# EAGLE design hello_radio_016 (EAGLE 5.10)
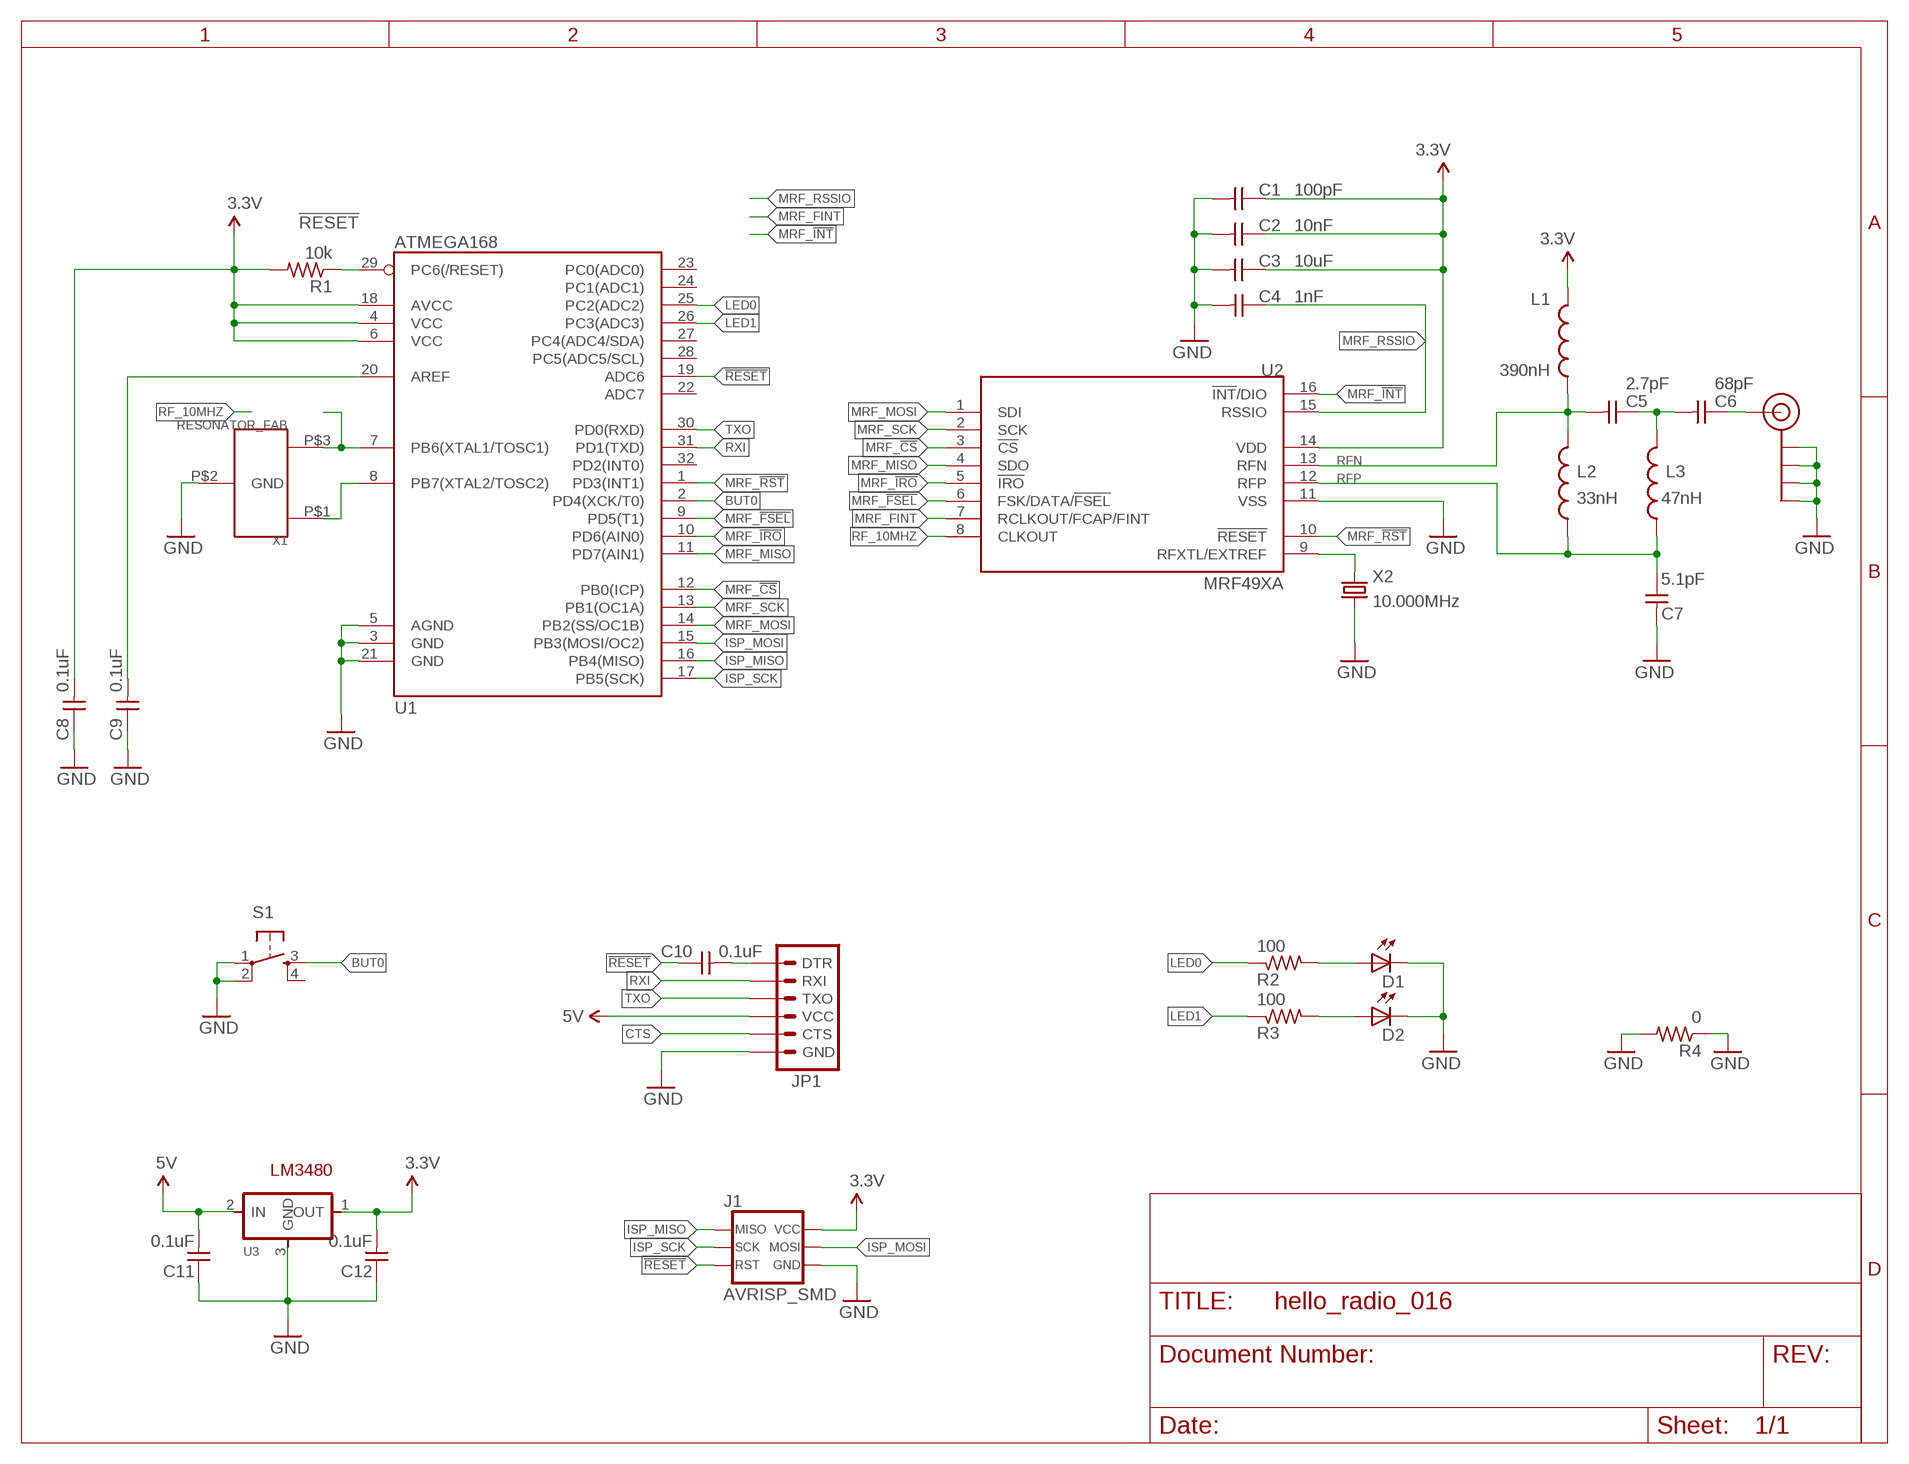
[diagram p0: schematic, sheet 1]

## Parts
C1  100pF  CAPACITOR_FAB_1206  [FAB_1206]
C2  10nF  CAPACITOR_FAB_1206  [FAB_1206]
C3  10uF  CAPACITOR_FAB_1206  [FAB_1206]
C4  1nF  CAPACITOR_FAB_1206  [FAB_1206]
C5  2.7pF  CAPACITOR_FAB_0603  [FAB_0603]
C6  68pF  CAPACITOR_FAB_0603  [FAB_0603]
C7  5.1pF  CAPACITOR_FAB_0603  [FAB_0603]
C8  0.1uF  CAPACITOR_FAB_1206  [FAB_1206]
C9  0.1uF  CAPACITOR_FAB_1206  [FAB_1206]
C10  0.1uF  CAPACITOR_FAB_1206  [FAB_1206]
C11  0.1uF  CAPACITOR_FAB_1206  [FAB_1206]
C12  0.1uF  CAPACITOR_FAB_1206  [FAB_1206]
D1  LED1206  [1206]
D2  LED1206  [1206]
J1  AVRISP_SMD  [2X03SMD]
J$1  SMA_EDGE  [SMA-EDGE]
JP1  FTDI_SERIAL_HEADER_SMD  [1X06_SMD]
L1  390nH  INDUCTOR_FAB_0603  [FAB_0603]
L2  33nH  INDUCTOR_FAB_0603  [FAB_0603]
L3  47nH  INDUCTOR_FAB_0603  [FAB_0603]
R1  10k  RESISTOR_FAB_1206  [FAB_1206]
R2  100  RESISTOR_FAB_1206  [FAB_1206]
R3  100  RESISTOR_FAB_1206  [FAB_1206]
R4  0  RESISTOR_FAB_1206  [FAB_1206]
S1  6MM_SWITCH  [6MM_SWITCH]
U1  ATMEGA168  ATMEGA168_FAB_TQFP32-08  [FAB_TQFP32-08]
U2  MRF49XA  MRF49XA_FAB_TSSOP16  [FAB_TSSOP16]
U3  REGULATOR_SOT23  [SOT23]
X1  RESONATOR_FAB  [FABCLASSRES]
X2  10.000MHz  CRYSTAL_ABM7  [CRYSTAL-SMD-ABM7]

## Nets
3.3V [power]: C1.1 C2.1 C3.1 C8.2 C12.2 J1.2(VCC) L1.1 R1.2 U1.4(VCC) U1.6(VCC) U1.18(AVCC) U2.14(VDD) U3.1(OUT)
5V [power]: C11.2 JP1.4(VCC) U3.2(IN)
!RESET: C10.1 J1.5(RST) R1.1 U1.19(ADC6) U1.29(PC6(/RESET))
BUT0: S1.3(S) U1.2(PD4(XCK/T0))
CTS: JP1.5(CTS)
DTR: C10.2 JP1.1(DTR)
GND [power]: C1.2 C2.2 C3.2 C4.2 C7.2 C8.1 C9.1 C11.1 C12.1 D1.2(C) D2.2(C) J1.6(GND) J$1.GND@0(GND) J$1.GND@1(GND) J$1.GND@2(GND) J$1.GND@3(GND) JP1.6(GND) R4.1 R4.2 S1.1(P) S1.2(P1) U1.3(GND) U1.5(AGND) U1.21(GND) U2.11(VSS) U3.3(GND) X1.P$2(GND) X2.P$1
ISP_MISO: J1.1(MISO) U1.16(PB4(MISO))
ISP_MOSI: J1.4(MOSI) U1.15(PB3(MOSI/OC2))
ISP_SCK: J1.3(SCK) U1.17(PB5(SCK))
LED0: R2.1 U1.25(PC2(ADC2))
LED1: R3.1 U1.26(PC3(ADC3))
MRF_!CS: U1.12(PB0(ICP)) U2.3(!CS)
MRF_!FSEL: U1.9(PD5(T1)) U2.6(FSK/DATA/!FSEL)
MRF_!INT: U2.16(!INT!/DIO)
MRF_!IRO: U1.10(PD6(AIN0)) U2.5(!IRO)
MRF_!RST: U1.1(PD3(INT1)) U2.10(!RESET)
MRF_FINT: U2.7(RCLKOUT/FCAP/FINT)
MRF_MISO: U1.11(PD7(AIN1)) U2.4(SDO)
MRF_MOSI: U1.14(PB2(SS/OC1B)) U2.1(SDI)
MRF_RSSIO: C4.1 U2.15(RSSIO)
MRF_SCK: U1.13(PB1(OC1A)) U2.2(SCK)
N$1: D1.1(A) R2.2
N$2: D2.1(A) R3.2
N$5: U1.8(PB7(XTAL2/TOSC2)) X1.P$1(A)
N$6: U1.7(PB6(XTAL1/TOSC1)) X1.P$3(B)
N$7: U2.9(RFXTL/EXTREF) X2.P$2
N$14: C9.2 U1.20(AREF)
RF$3 [RF]: C5.1 C6.2 L3.1
RF_10MHZ: U2.8(CLKOUT)
RF_OUT [RF]: C6.1 J$1.SIG(SIGNAL)
RFN [RF]: C5.2 L1.2 L2.1 U2.13(RFN)
RFP [RF]: C7.1 L2.2 L3.2 U2.12(RFP)
RXI: JP1.2(RXI) U1.31(PD1(TXD))
TXO: JP1.3(TXO) U1.30(PD0(RXD))
Unconnected: S1.4(S1) U1.22(ADC7) U1.23(PC0(ADC0)) U1.24(PC1(ADC1)) U1.27(PC4(ADC4/SDA)) U1.28(PC5(ADC5/SCL)) U1.32(PD2(INT0))

## Notes on the sheet
- LM3480

## Library data of the parts
C1-C12 = hello_radio_016:CAPACITOR: Capacitor Standard 0603 ceramic capacitor, and 0.1" leaded capacitor.
D1 D2 = hello_radio_016:LED
J1 = hello_radio_016:AVRISP
J$1 = hello_radio_016:SMA: SMA Antenna Connector End launch SMA connector. The paste layer has been removed so that the connector can be hand soldered onto the board after reflow.
JP1 = hello_radio_016:FTDI_SERIAL_HEADER
L1-L3 = hello_radio_016:INDUCTOR: Inductors Basic Inductor/Choke - 0603 and 1206. Footprints are not proven and vary greatly between part numbers.
R1-R4 = hello_radio_016:RESISTOR
S1 = hello_radio_016:6MM_SWITCH: OMRON SWITCH
U1 = hello_radio_016:ATMEGA168
U2 = hello_radio_016:MRF49XA
U3 = hello_radio_016:REGULATOR
X1 = hello_radio_016:RESONATOR
X2 = hello_radio_016:CRYSTAL: Crystals Various standard crystals. Proven footprints. Spark Fun Electronics SKU : COM-00534

## Net classes
1 power: width 0.254 mm

## Board
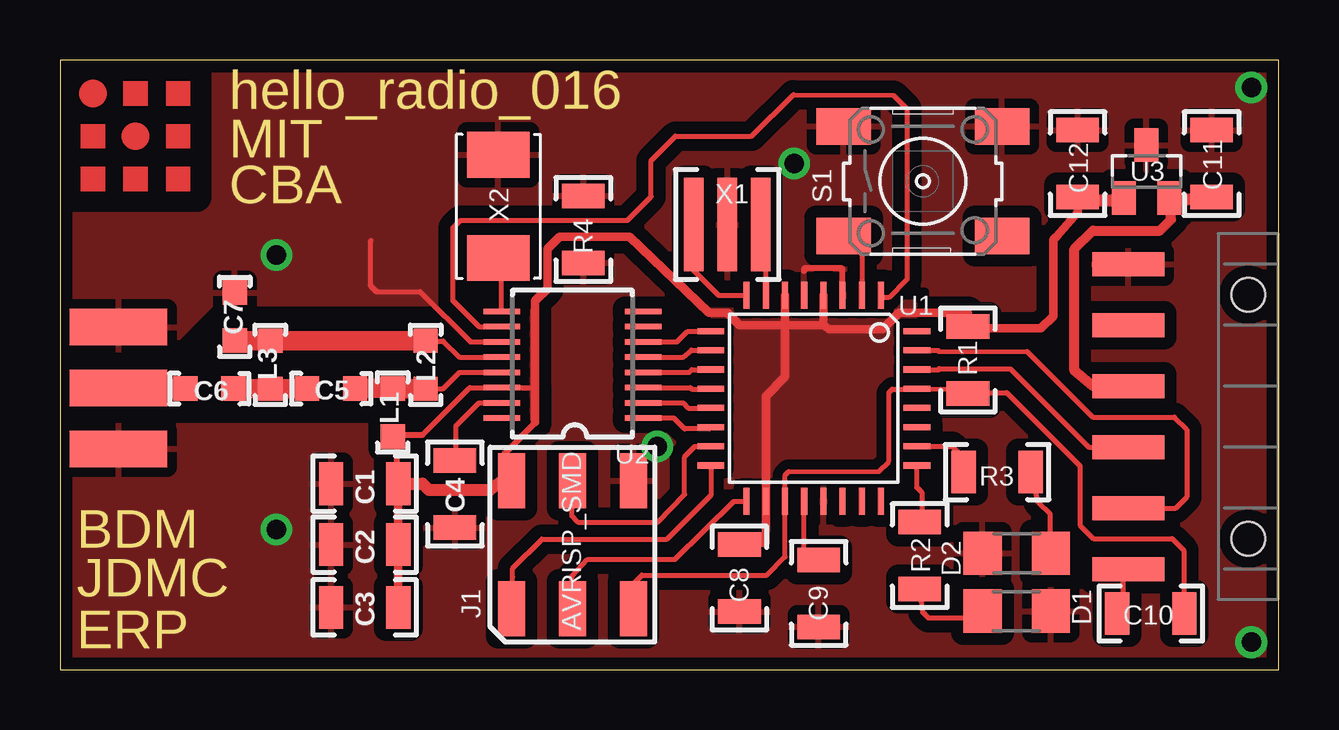
[diagram p1: board, top side]
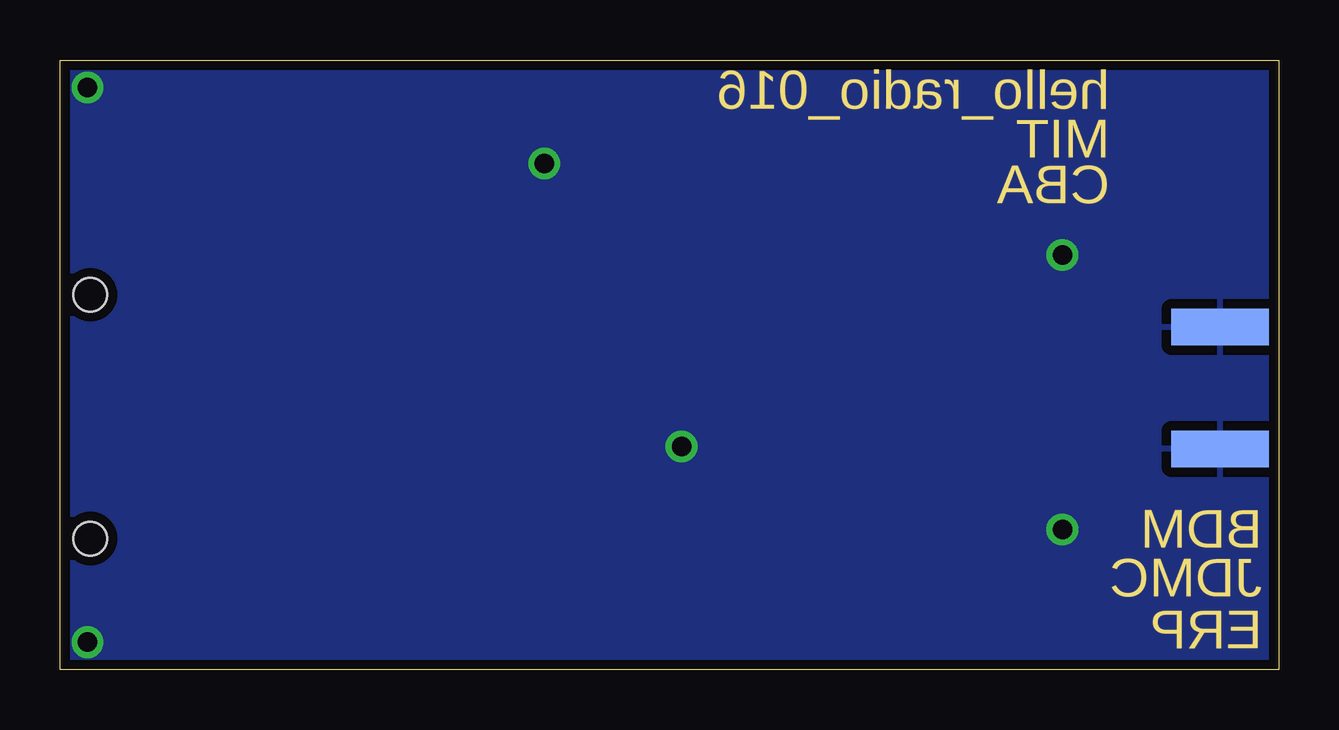
[diagram p2: board, bottom side, seen from below]

Size 50.8 x 25.4 mm. Coordinates in mm from the lower left corner, seen from the top.
Outline: 50.8,0 50.8,25.4 0,25.4 0,0 50.8,0
Copper layers (1*16): Top 0.035mm / dielectric 1.5mm / Bottom 0.035mm
Design rules "hr-fab-01 *": minimum track width 8mil, minimum drill 20mil, track to track 16mil, track to pad 16mil, pad to pad 16mil, via to via 16mil, smd to smd 0mil, copper to edge 16mil, drill to drill 20mil, minimum pad ring 10mil, minimum via ring 10mil, stop-mask expansion 4mil, vias tented up to drill 0mil, thermal gap 16mil
tRestrict: 4 lines

### Footprints (pad centres in the part's own frame; a part is rotated, then mirrored left to right if it is on the bottom)
FAB_1206 = smd 1.016 x 1.778: 1 -1.397,0; 2 1.397,0
FAB_0603 = smd 1.016 x 1.016: 1 -1,0; 2 1,0
1206 = smd 1.6 x 1.803: 1 -1.422,0; 2 1.422,0
2X03SMD = smd 2.286 x 1.118: 1 -2.667,2.54; 2 2.666,2.54; 3 -2.667,0; 4 2.666,0; 5 -2.667,-2.54; 6 2.666,-2.54
SMA-EDGE = smd 1.524 x 4.064: GND@0 0,0; GND@1 5.08,0; SIG 2.54,0 | smd 1.524 x 4.064 bottom: GND@2 0,0; GND@3 5.08,0
1X06_SMD = smd 1 x 3: 1 -6.35,5; 2 -3.81,5; 3 -1.27,5; 4 1.27,5; 5 3.81,5; 6 6.35,5 | hole 1.4: -5.08,0; 5.08,0
6MM_SWITCH = smd 2.286 x 1.524: 1 -3.302,2.286; 2 3.302,2.286; 3 -3.302,-2.286; 4 3.302,-2.286
FAB_TQFP32-08 = smd 1.118 x 0.254: 1 -4.293,2.8; 2 -4.293,2; 3 -4.293,1.2; 4 -4.293,0.4; 5 -4.293,-0.4; 6 -4.293,-1.2; 7 -4.293,-2; 8 -4.293,-2.8; 17 4.293,-2.8; 18 4.293,-2; 19 4.293,-1.2; 20 4.293,-0.4; 21 4.293,0.4; 22 4.293,1.2; 23 4.293,2; 24 4.293,2.8 | smd 0.254 x 1.118: 9 -2.8,-4.293; 10 -2,-4.293; 11 -1.2,-4.293; 12 -0.4,-4.293; 13 0.4,-4.293; 14 1.2,-4.293; 15 2,-4.293; 16 2.8,-4.293; 25 2.8,4.293; 26 2,4.293; 27 1.2,4.293; 28 0.4,4.293; 29 -0.4,4.293; 30 -1.2,4.293; 31 -2,4.293; 32 -2.8,4.293
FAB_TSSOP16 = smd 0.229 x 1.524: 1 -2.223,-2.85; 2 -1.587,-2.85; 3 -0.953,-2.85; 4 -0.318,-2.85; 5 0.318,-2.85; 6 0.953,-2.85; 7 1.587,-2.85; 8 2.223,-2.85; 9 2.223,3.05; 10 1.587,3.05; 11 0.953,3.05; 12 0.318,3.05; 13 -0.318,3.05; 14 -0.953,3.05; 15 -1.587,3.05; 16 -2.223,3.05
SOT23 = smd 1 x 1.4: 1 -0.95,-1.1; 2 0.95,-1.1; 3 0,1.1
FABCLASSRES = smd 0.8 x 3.9: P$1 -1.397,0; P$2 0,0; P$3 1.397,0
CRYSTAL-SMD-ABM7 = smd 1.9 x 2.6: P$1 -2.15,0; P$2 2.15,0

### Placement (x,y rotation side)
C1  12.7,7.75 180 top
C2  12.7,5.21 180 top
C3  12.7,2.59 180 top
C4  16.46,7.32 270 top
C5  11.3,11.71 0 top
C6  6.22,11.71 0 top
C7  7.29,14.71 90 top
C8  28.32,3.81 90 top
C9  31.62,3.17 90 top
C10  45.47,2.34 180 top
C11  48.01,21.08 270 top
C12  42.42,21.08 270 top
D1  39.88,2.44 0 top
D2  39.88,4.85 180 top
J1  21.36,5.21 90 top
J$1  2.44,14.27 270 top
JP1  49.53,10.54 90 top
L1  13.87,10.72 90 top
L2  15.24,12.7 90 top
L3  8.76,12.7 90 top
R1  37.85,12.9 90 top
R2  35.84,4.75 270 top
R3  39.07,8.23 0 top
R4  21.82,18.34 90 top
S1  35.97,20.35 0 top
U1  31.42,11.3 270 top
U2  21.46,12.7 90 top
U3  45.29,20.75 0 top
U$1  [CBA]  3.15,22.23 0 top
X1  27.81,18.54 0 top
X2  18.26,19.3 270 top

### Tracks (layer width: path | path; a pad name or v marks a point on that pad's centre or on a via)
3.3V
  Top 0.203: 15.11,9.78 17.08,11.75 U2.14 19.75,11.75
  Top 0.254: 13.87,7.92 C1.1 14.06,7.66 14.06,9.78 | 44.27,19.59 U3.1 44.34,19.56 | 37.85,14.86 R1.2 | U1.6 | C8.2 27.94,5.36 | 42.44,19.56 42.42,19.56 | 18.41,7.9 18.44,7.87 J1.2 18.54,7.97 18.54,9.02 19.81,10.29 19.81,10.31 | 19.75,11.75 19.81,11.68 | 14.06,9.78 15.11,9.78 | 14.06,9.78 13.93,9.78 L1.1
  Top 0.356: C1.1 C2.1 C3.1 | 42.44,19.56 42.42,19.05 41.53,18.03 41.4,17.91 41.4,14.73 40.89,14.22 38.23,14.22 37.85,14.61 37.85,14.86 34.98,14.86 34.29,14.17 32.07,14.17 31.82,14.35 | 30.23,14.35 30.23,12.19 29.42,11.39 U1.18 29.42,6.18 29.41,5.28 C8.2 28.3,5.21 | 30.23,14.35 U1.6 | 31.82,14.35 U1.4 | 30.23,14.35 31.82,14.35 | 19.81,10.31 19.81,11.68 19.81,15.37 20.32,15.88 20.32,17.53 20.83,18.03 23.75,18.03 27.05,14.86 27.81,14.86 28.32,14.35 30.23,14.35
  Top 0.508: 42.44,19.56 44.34,19.56 | 42.42,19.56 C12.2 | C1.1 15.11,7.75 15.37,7.49 17.91,7.49 18.44,7.87
  pour Top: 27.3,15.24 35.56,15.24 35.56,7.62 27.3,7.62
  pour Top: 18.41,14.94 19.81,14.94 19.81,10.46 18.41,10.46
5V
  Top 0.254: 46.25,19.66 U3.2 46.3,19.59
  Top 0.406: 46.3,19.59 46.3,18.75 45.85,18.29 43.05,18.29 42.29,17.53 42.29,12.45 43.05,11.81 JP1.4
  Top 0.508: C11.2 46.24,19.53 U3.2
!RESET
  Top 0.203: C10.1 46.84,2.47 46.84,4.98 46.35,5.46 43.08,5.46 42.52,6.02 42.52,8.48 39.46,11.54 37.65,11.54 R1.1 37.58,11.69 U1.29 35.69,11.68 34.7,11.68 34.54,11.53 34.54,8.66 34.14,8.25 30.37,8.25 30.22,8.1 U1.19 30.23,4.7 29.46,3.94 24.26,3.94 23.88,3.56 23.88,2.92 J1.5
BUT0
  Top 0.203: U1.2 33.42,17.29 33.53,17.4 33.33,17.4 S1.3
DTR
  Top 0.203: JP1.1 44.33,3.99 44.32,2.29 43.79,2.29 C10.2
GND  (via drill 0.81 pad 1.27)
  Top 0.203: U2.11 17.11,13.65 15.01,15.75 13.21,15.75 | 12.95,16 12.95,17.87
  Top 0.254: 12.95,16 13.21,15.75 | U1.3 32.61,16.71 31.01,16.71 31.01,16.61
  other vias: 30.61,21.08 49.66,1.14 49.66,24.26 9.02,17.27 9.02,5.84 24.89,9.3
  pour Bottom (rank 2): 0,0 50.8,0 50.8,25.4 0,25.4
  pour Top (isolate 0.508, rank 4): 50.8,25.4 0,25.4 0,13.34 4.45,13.34 6.35,15.24 18.29,15.24 18.29,10.16 0,10.16 0,0 50.8,0
ISP_MISO
  Top 0.203: U1.16 27.15,8.48 27.15,7.29 25.3,5.44 20.09,5.44 18.87,4.22 18.87,3.86 J1.1
ISP_MOSI
  Top 0.203: J1.4 21.34,6.4 21.59,6.15 24.92,6.15 26.04,7.29 26.04,8.87 26.47,9.3 U1.15
ISP_SCK
  Top 0.203: J1.3 21.34,3.89 22,4.6 25.63,4.6 28.09,7.01 U1.17
LED0
  Top 0.203: U1.25 35.71,7.59 35.94,7.37 35.94,6.5 R2.1
LED1
  Top 0.203: U1.26 37.18,9.3 37.47,9.02 37.47,8.35 R3.1
MRF_!CS
  Top 0.203: U2.3 26.28,11.75 26.34,11.68 27.11,11.68 U1.12
MRF_!FSEL
  Top 0.203: U2.6 25.72,13.65 26.16,14.1 U1.9
MRF_!IRO
  Top 0.203: U2.5 25.97,13.02 26.31,13.31 U1.10
MRF_!RST
  Top 0.203: U2.10 17.46,14.29 16.38,15.37 16.38,18.41 16.69,18.72 23.65,18.72 24.64,19.71 24.64,21.21 25.65,22.23 28.83,22.23 30.58,23.95 34.75,23.93 35.31,23.37 35.31,16.26 34.54,15.49 34.32,15.49 U1.1
MRF_MISO
  Top 0.203: U2.4 26.23,12.38 26.34,12.5 U1.11
MRF_MOSI
  Top 0.203: U2.1 25.59,10.48 26.04,10.03 27.06,10.03 U1.14
MRF_RSSIO
  Top 0.203: U2.15 17.46,11.11 16.51,10.16 16.51,9.09 C4.1
MRF_SCK
  Top 0.203: U2.2 25.97,11.11 26.19,10.9 U1.13
N$1
  Top 0.203: R2.2 35.97,2.39 36.2,2.16 38.18,2.16 D1.1
N$2
  Top 0.203: R3.2 40.79,6.96 41.27,6.48 41.27,4.88 D2.1
N$5
  Top 0.203: U1.8 27.46,15.6 26.42,16.64 X1.P$1 26.42,18.99
N$6
  Top 0.203: U1.7 29.42,18.97 X1.P$3
N$7
  Top 0.203: U2.9 18.41,17.03 X2.P$2
N$14
  Top 0.203: U1.20 31.02,4.49 31.62,4.49 C9.2
RF$3
  Top 0.203: L3.1 8.9,11.71 | C6.2 7.36,11.7
  Top 0.813: 8.9,11.71 C5.1 | 7.36,11.7 L3.1
RF_OUT
  Top 0.203: J$1.SIG 2.49,11.71
  Top 0.813: 2.49,11.71 C6.1
RFN
  Top 0.203: U2.13 16.65,12.38 15.98,11.71 L2.1 | L1.2 13.68,11.71 | C5.2 12.26,11.72
  Top 0.813: 13.68,11.71 L2.1 | 12.26,11.72 L1.2
RFP
  Top 0.203: U2.12 16.65,13.02 15.98,13.69 L2.2 | 8.88,13.71 L3.2
  Top 0.813: C7.1 8.88,13.71 | L3.2 L2.2
RXI
  Top 0.203: JP1.2 44.55,6.71 46.48,6.71 46.97,7.19 46.97,10.01 46.46,10.52 43.05,10.52 40.32,13.25 36.63,13.26 36.63,13.3 U1.31
TXO
  Top 0.203: JP1.3 42.88,9.27 39.62,12.53 36.65,12.53 | U1.30 36.65,12.5 36.65,12.53 | 36.65,12.53 36.65,12.55

### Text on the board
Milling: MIT | CBA | BDM | JDMC | ERP